# Altium schematic sheet Preamp.SchDoc
size A
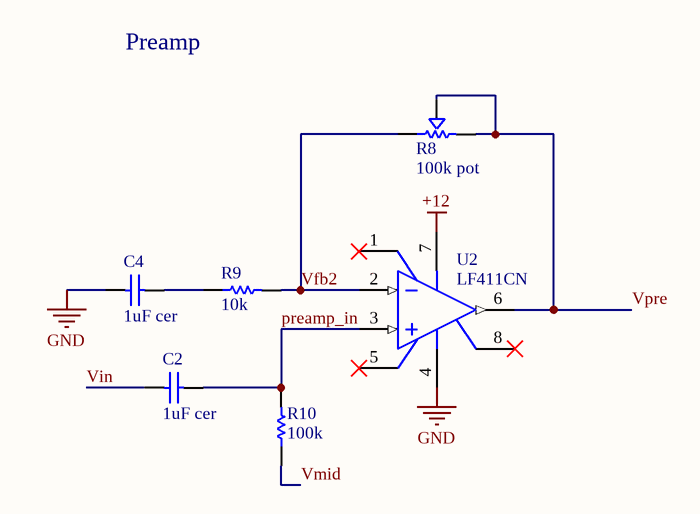
[diagram p0: Preamp.SchDoc]

## Parts
C2  1uF cer  [PCB-19304320-1]
C4  1uF cer  [PCB-19304320-1]
R8  100k pot  [PCB-urdemwrt71ubtqm2k8m7-1]
R9  10k  [PCB-ufx52wqpb97u1085hkka-1]
R10  100k  [PCB-ufx52wqpb97u1085hkka-1]
U2  LF411CN  [N08E]

## Nets
+12: U2.7(V+)
GND: C4.1 U2.4(V-)
preamp_in: C2.2 R10.2 U2.3(IN+)
Vfb2: R8.1 R9.2 U2.2(IN-)
Vin: C2.1
Vmid: R10.1
Vpre: R8.2 R8.3 U2.6(OUT)
NetC4_2: C4.2 R9.1

Not connected (* = marked no-connect by the designer): U2 1(BAL)* 5(BAL)* 8(NC)*

## Notes on the sheet
- Preamp

## Library data of the parts
C2 C4 = C330C105K5R5TA: Capacitor; Ceramic; Cap 1.00uF; Tol 10%; Radial; Vol-Rtg 50V; Lead-Free Status: Lead Free; Capacitance: 1.00 µF; Voltage Rating (DC): 50.0 V; Lead Length: 7.00 mm; Dielectric Characteristic: X7R; Size-Height: 9.14 mm; Number of Pins: 2; Mounting Style: Through Hole; OctopartID: bb267075e97664e1; REACH SVHC Compliance: No SVHC; Octopart URL: http://octopart.com/c330c105k5r5ta-kemet-39417654; Packaging: Bulk; Capacitance Tolerance: ±10%; Manufacturer Part Number: C330C105K5R5TA; Size-Length: 7.62 mm; RoHS: Compliant
R8 = CMP-1209584-8: Res Conductive Plastic POT 50K Ohm 20% 1/4W 1Turn 3.18mm Pin Panel Mount/Through Hole; Manufacturer Part Number: 3310C-001-503L; Resistance: 50.0 kΩ; Lead-Free Status: Lead Free; Power Rating: 250 mW; Resistance Tolerance: ±20%; Size-Length: 9.52 mm; Octopart URL: http://octopart.com/3310c-001-503l-bourns-578521; OctopartID: f7063e0401b928c1; RoHS: Compliant
R9 R10 = CFR50J10K: Through Hole Carbon Film Resistor, CFR Series, 10 kohm, 500 mW, - 5%, 350 V, Axial Leaded
U2 = LF411CN: Low Offset, Low Drift JFET Input Operational Amplifier, 8-pin MDIP; Bandwidth: 4000000.0 Hz; Input Offset Drift: 7e-06 V/K; Lead-Free Status: Contains Lead; Number of Channels: 1; Output Current: 0.025 A; Slew Rate: 15.0 V/μs; Supply Voltage (DC): 44.0 V; Case/Package: DIP; Gain Bandwidth Product: 4000000.0 Hz; Lifecycle Status: Active; Mounting Style: Through Hole; Number of Pins: 8; Octopart Url: https://octopart.com/lf411cn-texas+instruments-24728701; OctopartID: f68f3efc87942948; Packaging: Rail; REACH SVHC Compliance: No SVHC; RoHS: Non-Compliant; Manufacturer Part Number: LF411CN